# EAGLE design M103X (EAGLE 6.6.0)
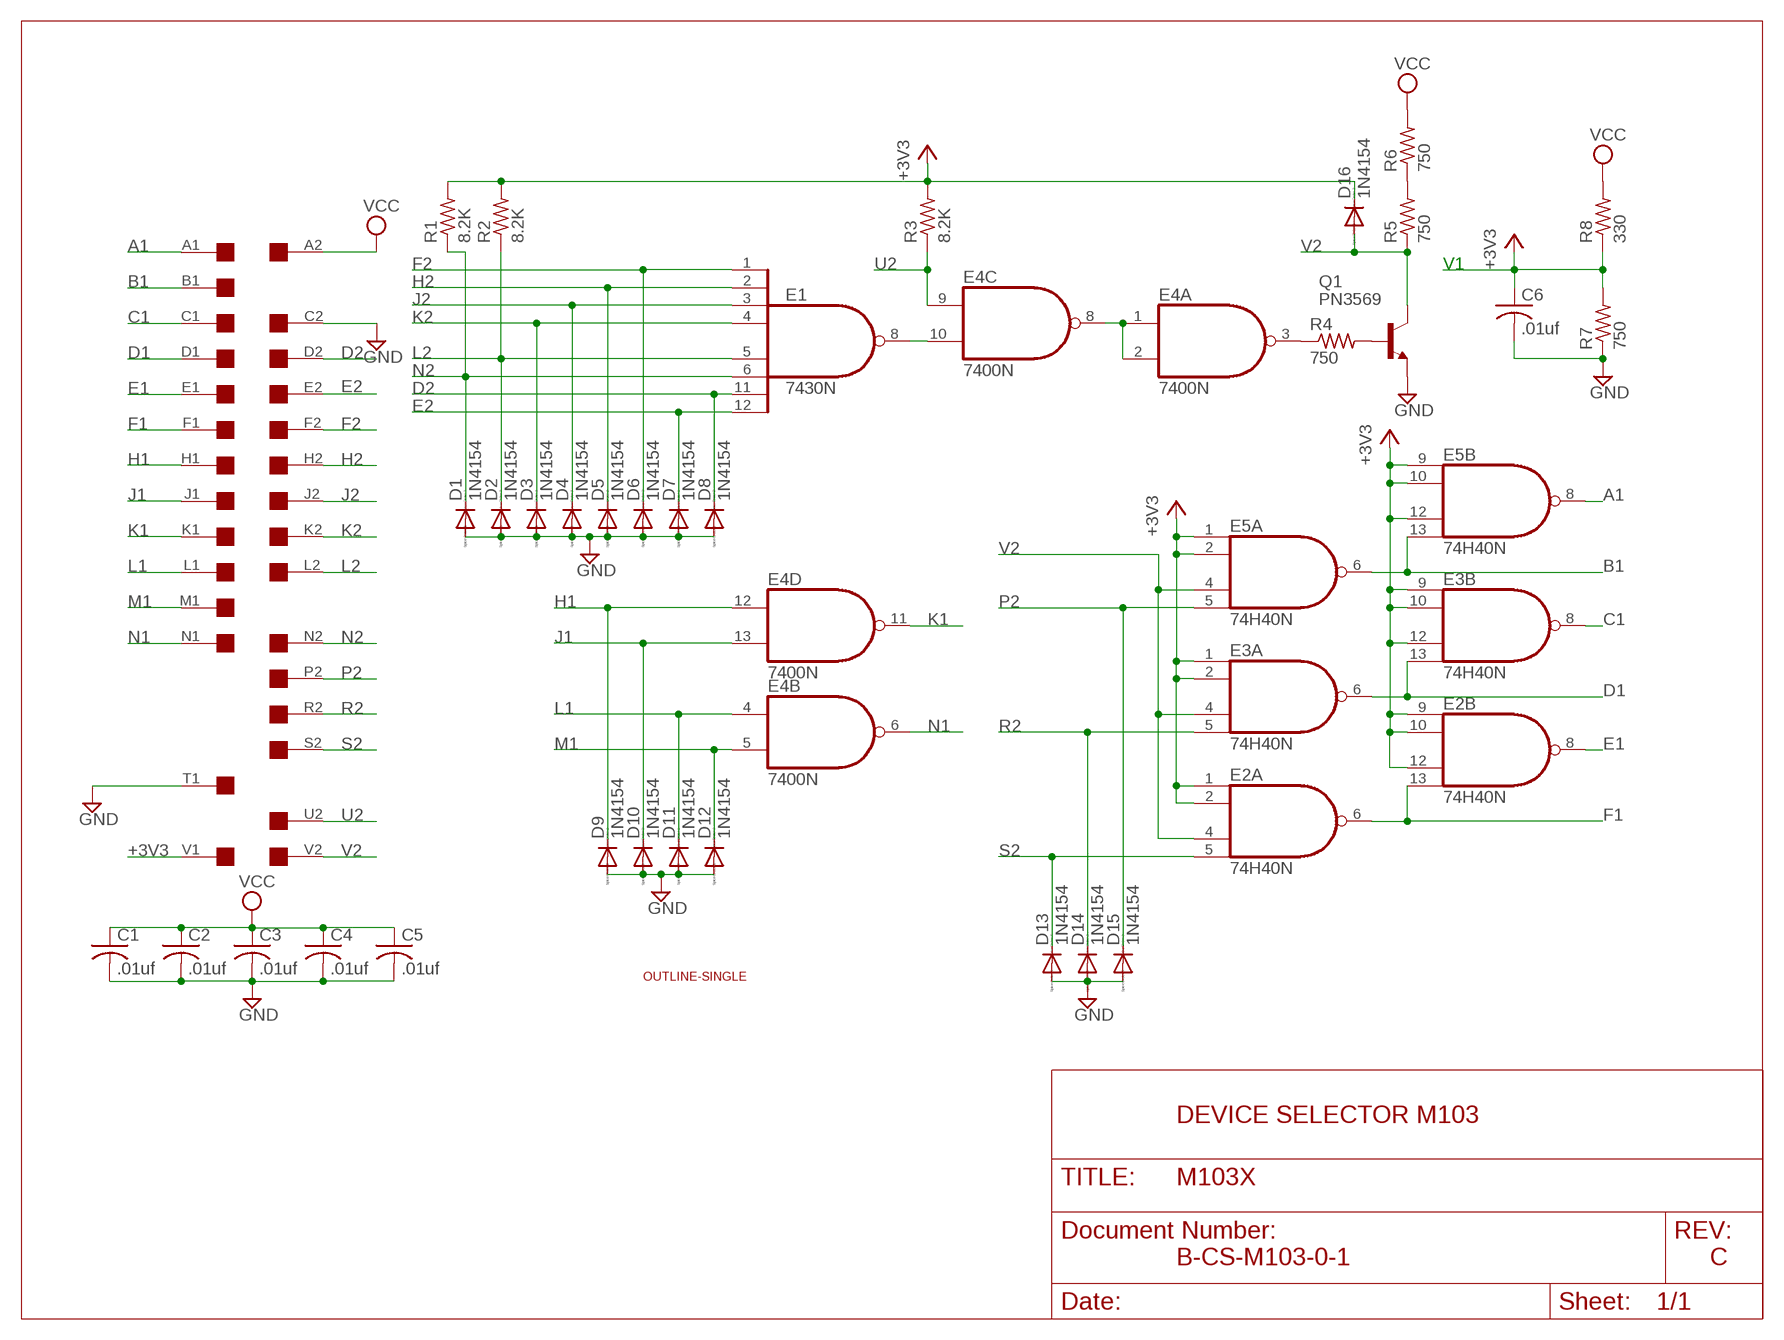
[diagram p0: schematic, sheet 1]

## Parts
C1  .01uf  C-US050-025X075  [C050-025X075]
C2  .01uf  C-US050-025X075  [C050-025X075]
C3  .01uf  C-US050-025X075  [C050-025X075]
C4  .01uf  C-US050-025X075  [C050-025X075]
C5  .01uf  C-US050-025X075  [C050-025X075]
C6  .01uf  C-US050-025X075  [C050-025X075]
D1  1N4154  1N4148DO35-10  [DO35-10]
D2  1N4154  1N4148DO35-10  [DO35-10]
D3  1N4154  1N4148DO35-10  [DO35-10]
D4  1N4154  1N4148DO35-10  [DO35-10]
D5  1N4154  1N4148DO35-10  [DO35-10]
D6  1N4154  1N4148DO35-10  [DO35-10]
D7  1N4154  1N4148DO35-10  [DO35-10]
D8  1N4154  1N4148DO35-10  [DO35-10]
D9  1N4154  1N4148DO35-10  [DO35-10]
D10  1N4154  1N4148DO35-10  [DO35-10]
D11  1N4154  1N4148DO35-10  [DO35-10]
D12  1N4154  1N4148DO35-10  [DO35-10]
D13  1N4154  1N4148DO35-10  [DO35-10]
D14  1N4154  1N4148DO35-10  [DO35-10]
D15  1N4154  1N4148DO35-10  [DO35-10]
D16  1N4154  1N4148DO35-10  [DO35-10]
E1  7430N  [DIL14]
E2  74H40N  74S20N  [DIL14]
E3  74H40N  74S20N  [DIL14]
E4  7400N  [DIL14]
E5  74H40N  74S20N  [DIL14]
Q1  PN3569  2N1613-NPN-TO39-EBC  [TO39]
R1  8.2K  R-US_0207/10  [0207/10]
R2  8.2K  R-US_0207/10  [0207/10]
R3  8.2K  R-US_0207/10  [0207/10]
R4  750  R-US_0207/10  [0207/10]
R5  750  R-US_0207/10  [0207/10]
R6  750  R-US_0207/10  [0207/10]
R7  750  R-US_0207/10  [0207/10]
R8  330  R-US_0207/10  [0207/10]
U$8  SINGLE  [EDGE-CON2]
U$9  OUTLINE-SINGLE  [SINGLE]

## Nets
+3V3: C6.1 D16.C E2.1(A:I0) E2.2(A:I1) E2.9(B:I0) E2.10(B:I1) E2.12(B:I2) E3.1(A:I0) E3.2(A:I1) E3.9(B:I0) E3.10(B:I1) E3.12(B:I2) E5.1(A:I0) E5.2(A:I1) E5.9(B:I0) E5.10(B:I1) E5.12(B:I2) R1.2 R2.2 R3.2 R7.2 R8.1 U$8.V1
A1: E5.8(B:O) U$8.A1
B1: E5.6(A:O) E5.13(B:I3) U$8.B1
C1: E3.8(B:O) U$8.C1
D1: E3.6(A:O) E3.13(B:I3) U$8.D1
D2: D8.C E1.11(I6) U$8.D2
E1: E2.8(B:O) U$8.E1
E2: D7.C E1.12(I7) U$8.E2
F1: E2.6(A:O) E2.13(B:I3) U$8.F1
F2: D6.C E1.1(I0) U$8.F2
GND: C1.2 C2.2 C3.2 C4.2 C5.2 C6.2 D1.A D2.A D3.A D4.A D5.A D6.A D7.A D8.A D9.A D10.A D11.A D12.A D13.A D14.A D15.A Q1.1(E) R7.1 U$8.C2 U$8.T1
H1: D9.C E4.12(D:I0) U$8.H1
H2: D5.C E1.2(I1) U$8.H2
J1: D10.C E4.13(D:I1) U$8.J1
J2: D4.C E1.3(I2) U$8.J2
K1: E4.11(D:O) U$8.K1
K2: D3.C E1.4(I3) U$8.K2
L1: D11.C E4.4(B:I0) U$8.L1
L2: D2.C E1.5(I4) R2.1 U$8.L2
M1: D12.C E4.5(B:I1) U$8.M1
N1: E4.6(B:O) U$8.N1
N2: D1.C E1.6(I5) R1.1 U$8.N2
N$2: E4.3(A:O) R4.1
N$3: Q1.2(B) R4.2
N$5: R5.2 R6.1
N$8: E1.8(O) E4.10(C:I1)
N$9: E4.1(A:I0) E4.2(A:I1) E4.8(C:O)
P2: D15.C E5.5(A:I3) U$8.P2
R2: D14.C E3.5(A:I3) U$8.R2
S2: D13.C E2.5(A:I3) U$8.S2
U2: E4.9(C:I0) R3.1 U$8.U2
V2: D16.A E2.4(A:I2) E3.4(A:I2) E5.4(A:I2) Q1.3(C) R5.1 U$8.V2
VCC: C1.1 C2.1 C3.1 C4.1 C5.1 R6.2 R8.2 U$8.A2
Unconnected: U$8.B2 U$8.M2 U$8.P1 U$8.R1 U$8.S1 U$8.T2 U$8.U1

## Notes on the sheet
- V1
- DEVICE SELECTOR M103
- B-CS-M103-0-1 | C

## Power pins joined to a net without a drawn wire
GND: E1.7(GND) E2.7(P:GND) E3.7(P:GND) E4.7(P:GND) E5.7(P:GND)
VCC: E1.14(VCC) E2.14(P:VCC) E3.14(P:VCC) E4.14(P:VCC) E5.14(P:VCC)

## Library data of the parts
C1-C6 = rcl:C-US: CAPACITOR, American symbol
D1-D16 = diode:1N4148: DIODE high speed (Philips)
E1 = 74xx-us:74*30: 8-input NAND gate
E2 E3 E5 = 74xx-us:74*20: Dual 4-input NAND gate
E4 = 74xx-us:74*00: Quad 2-input NAND gate
Q1 = transistor:*-NPN-: NPN Transistror BF959 corrected 2008.03.06
R1-R8 = rcl:R-US_: RESISTOR, American symbol
U$8 = dec-con:SINGLE: Single-Height DEC board
U$9 = dec-con:OUTLINE-*: Board outlines for DEC boards.

## Board
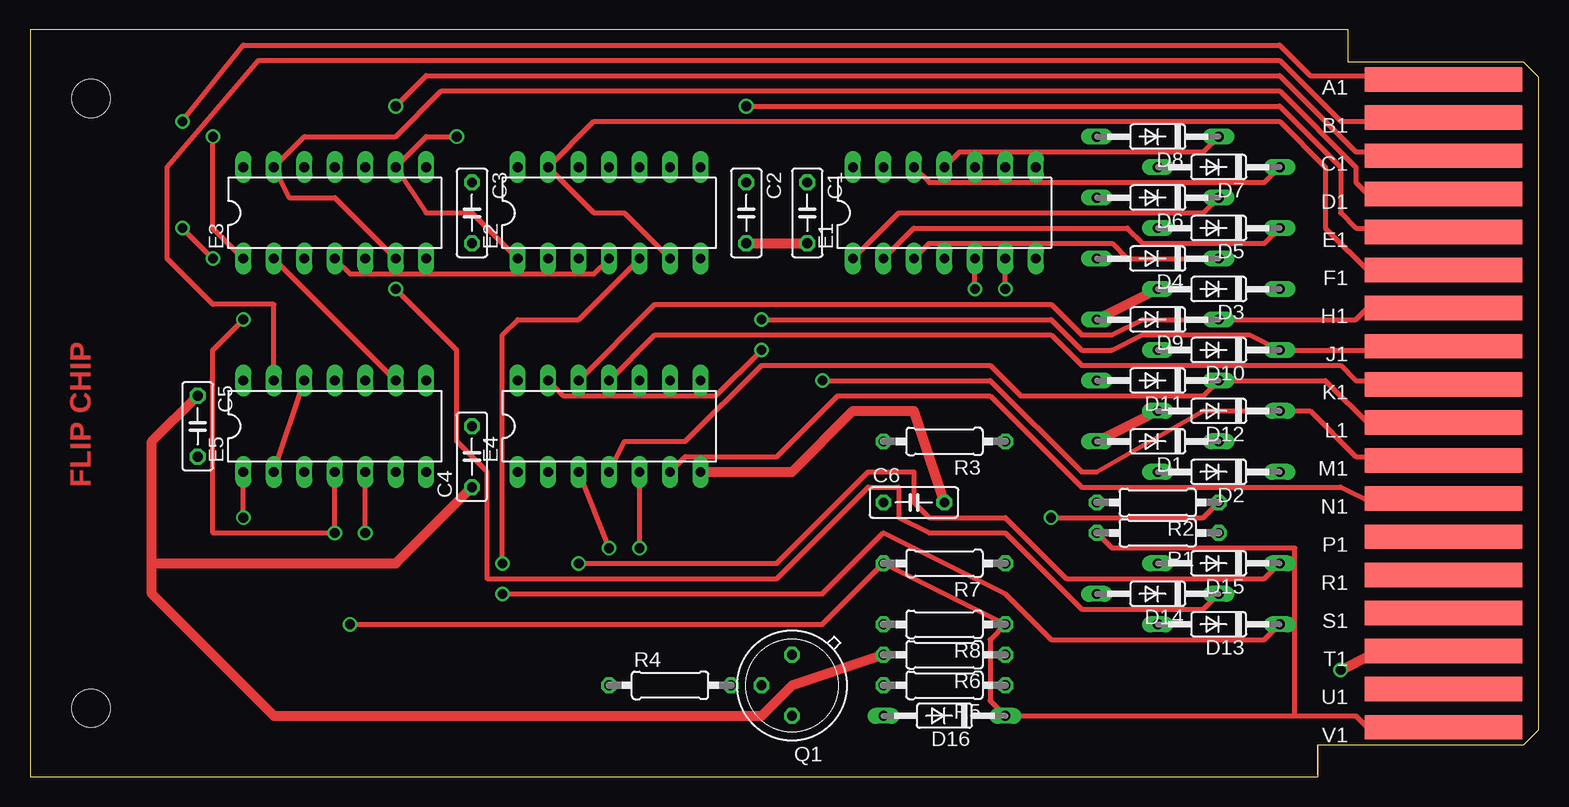
[diagram p1: board, top side]
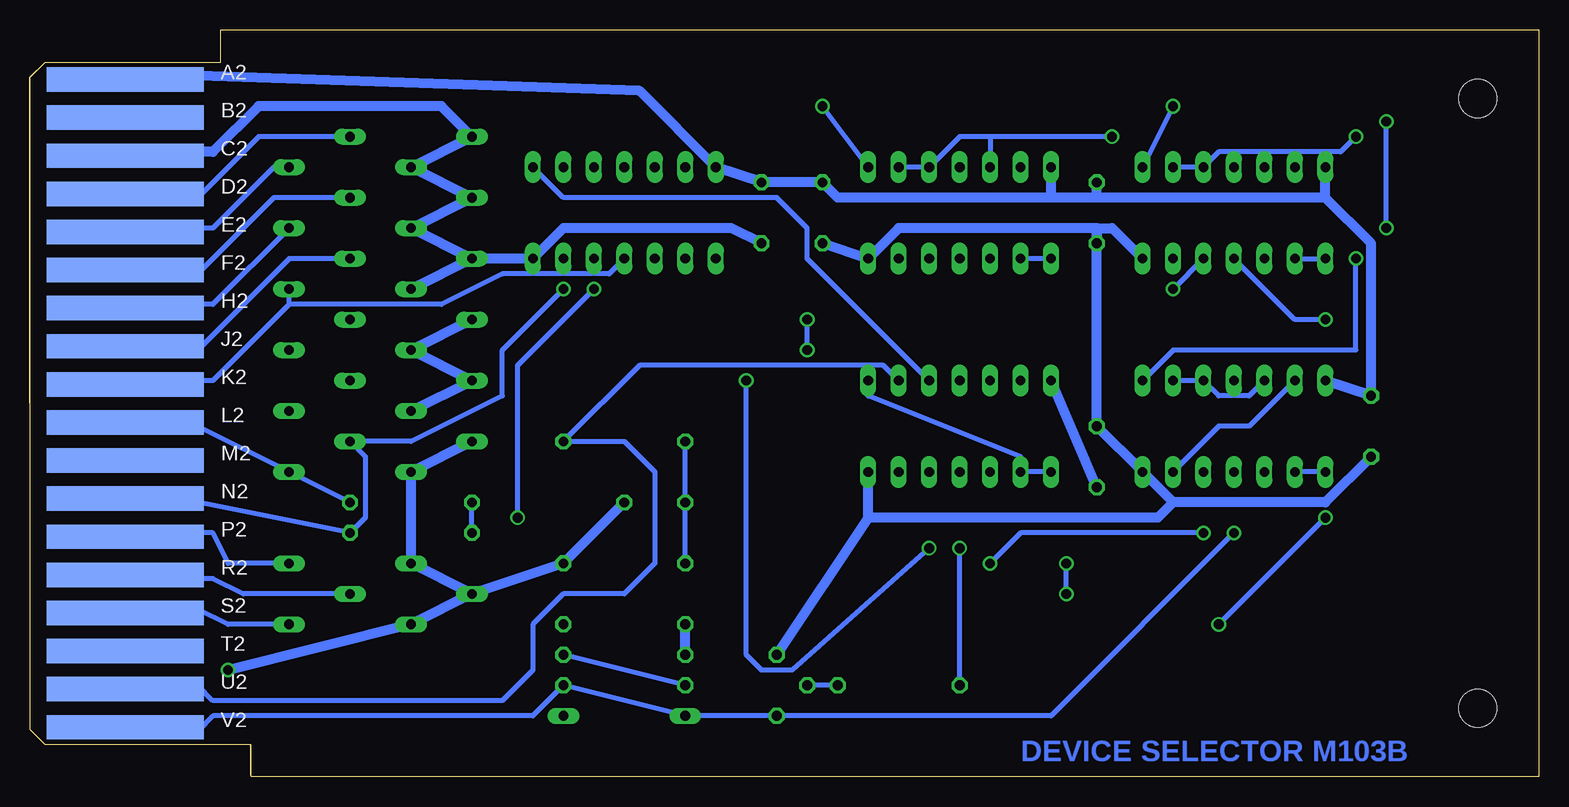
[diagram p2: board, bottom side, seen from below]

Size 125.73 x 62.23 mm. Coordinates in mm from the lower left corner, seen from the top.
Copper layers (1+16): Top 0.035mm / dielectric 1.5mm / Bottom 0.035mm
Design rules "16mils": minimum track width 16mil, minimum drill 32mil, track to track 15mil, track to pad 10mil, pad to pad 10mil, via to via 10mil, smd to smd 10mil, copper to edge 13mil, drill to drill 10mil, minimum pad ring 10mil, minimum via ring 8mil, stop-mask expansion 0mil, vias tented up to drill 0mil, thermal gap 10mil

### Footprints (pad centres in the part's own frame; a part is rotated, then mirrored left to right if it is on the bottom)
C050-025X075 = drill 0.813 octagon: 1 -2.54,0; 2 2.54,0
DO35-10 = drill 0.813 long: A 5.08,0; C -5.08,0
DIL14 = drill 0.813 long: 1 -7.62,-3.81; 2 -5.08,-3.81; 3 -2.54,-3.81; 4 0,-3.81; 5 2.54,-3.81; 6 5.08,-3.81; 7 7.62,-3.81; 8 7.62,3.81; 9 5.08,3.81; 10 2.54,3.81; 11 0,3.81; 12 -2.54,3.81; 13 -5.08,3.81; 14 -7.62,3.81
TO39 = drill 0.813 octagon: 1 0,-2.54; 2 2.54,0; 3 0,2.54
0207/10 = drill 0.813 octagon: 1 -5.08,0; 2 5.08,0
EDGE-CON2 = smd 13.106 x 2.032: A1 7.938,4.128; B1 7.938,7.303; C1 7.938,10.477; D1 7.938,13.652; E1 7.938,16.828; F1 7.938,20.003; H1 7.938,23.177; J1 7.938,26.352; K1 7.938,29.527; L1 7.938,32.703; M1 7.938,35.877; N1 7.938,39.053; P1 7.938,42.227; R1 7.938,45.403; S1 7.938,48.578; T1 7.938,51.752; U1 7.938,54.928; V1 7.938,58.102 | smd 13.106 x 2.032 bottom: A2 7.938,4.128; B2 7.938,7.303; C2 7.938,10.477; D2 7.938,13.652; E2 7.938,16.828; F2 7.938,20.003; H2 7.938,23.177; J2 7.938,26.352; K2 7.938,29.527; L2 7.938,32.703; M2 7.938,35.877; N2 7.938,39.053; P2 7.938,42.227; R2 7.938,45.403; S2 7.938,48.578; T2 7.938,51.752; U2 7.938,54.928; V2 7.938,58.102
SINGLE = hole 3.175: 120.65,56.515; 120.65,5.715

### Placement (x,y rotation side)
C1  64.77,46.99 270 top
C2  59.69,46.99 270 top
C3  36.83,46.99 270 top
C4  36.83,26.67 90 top
C5  13.97,29.21 270 top
C6  73.66,22.86 0 top
D1  93.98,27.94 180 top
D2  99.06,25.4 180 top
D3  99.06,40.64 180 top
D4  93.98,43.18 180 top
D5  99.06,45.72 180 top
D6  93.98,48.26 180 top
D7  99.06,50.8 180 top
D8  93.98,53.34 180 top
D9  93.98,38.1 180 top
D10  99.06,35.56 180 top
D11  93.98,33.02 180 top
D12  99.06,30.48 180 top
D13  99.06,12.7 180 top
D14  93.98,15.24 180 top
D15  99.06,17.78 180 top
D16  76.2,5.08 180 top
E1  76.2,46.99 0 top
E2  48.26,46.99 0 top
E3  25.4,46.99 0 top
E4  48.26,29.21 0 top
E5  25.4,29.21 0 top
Q1  63.5,7.62 180 top
R1  93.98,20.32 180 top
R2  93.98,22.86 180 top
R3  76.2,27.94 180 top
R4  53.34,7.62 0 top
R5  76.2,7.62 180 top
R6  76.2,10.16 180 top
R7  76.2,17.78 180 top
R8  76.2,12.7 180 top
U$8  125.73,62.23 180 top
U$9  125.73,62.23 180 top

### Tracks (layer width: path | path; a pad name or v marks a point on that pad's centre or on a via)
+3V3  (via drill 0.81)
  Top 0.406: U$8.V1 111.76,3.81 110.49,5.08 105.41,5.08 | 105.41,5.08 D16.C 80.01,6.35 80.01,11.43 R8.1 R7.2 66.04,12.7 v26.67,12.7 | R1.2 90.17,19.05 105.41,19.05 105.41,5.08 | E5.9 E3.2 | v15.24,53.34 15.24,45.72 E3.1 | v17.78,21.59 E5.1 | E5.2 E5.12 | v35.56,53.34 33.02,53.34 E3.9 33.02,46.99 36.83,46.99 E2.1
  Bottom 0.406: R7.2 C6.1 R3.2 | R1.2 R2.2 | E2.1 E2.2 | E3.9 E3.10 26.67,52.07 22.86,52.07 | 22.86,52.07 E3.12 | 22.86,52.07 16.51,52.07 v15.24,53.34 | E3.2 E3.1 | E5.9 E5.10 26.67,31.75 24.13,31.75 E5.12 | E5.1 E5.2 | v26.67,12.7 v17.78,21.59 | v35.56,53.34 45.72,53.34 | 45.72,53.34 E2.12 | 45.72,53.34 48.26,53.34 E2.10 E2.9
A1  (via drill 0.81)
  Top 0.406: U$8.A1 111.76,58.02 111.76,58.42 106.68,58.42 104.14,60.96 17.78,60.96 v12.7,54.61 | v15.24,43.18 v12.7,45.72
  Bottom 0.406: v12.7,45.72 v12.7,54.61 | E5.8 30.48,35.56 15.24,35.56 v15.24,43.18
B1
  Top 0.406: U$8.B1 112.05,54.9 111.76,54.61 109.22,54.61 104.14,59.69 19.05,59.69 11.43,50.8 11.43,43.18 15.24,39.37 20.32,39.37 E5.13
  Bottom 0.406: E5.6 26.67,29.21 24.13,29.21 E5.13
C1  (via drill 0.81)
  Top 0.406: U$8.C1 112.09,51.74 111.76,52.07 110.49,52.07 104.14,58.42 33.02,58.42 v30.48,55.88
  Bottom 0.406: E3.8 v30.48,55.88
D1
  Top 0.406: U$8.D1 112.06,48.56 111.76,48.26 110.49,49.53 110.49,50.8 104.14,57.15 34.29,57.15 30.48,53.34 22.86,53.34 E3.13 21.59,48.26 25.4,48.26 E3.6
D2
  Top 0.406: D8.C 97.79,52.07 77.47,52.07 E1.11
  Bottom 0.406: U$8.D2 111.76,48.26 106.68,53.34 D8.C
E1  (via drill 0.81)
  Top 0.406: U$8.E1 111.76,45.72 110.49,45.72 109.22,46.99 109.22,50.8 104.14,55.88 v59.69,55.88
  Bottom 0.406: E2.8 v59.69,55.88
E2
  Top 0.406: D7.C 102.87,49.53 74.93,49.53 E1.12
  Bottom 0.406: U$8.E2 111.76,45.72 110.49,45.72 105.41,50.8 D7.C
F1
  Top 0.406: U$8.F1 111.76,41.91 107.95,45.72 107.95,50.8 104.14,54.61 46.99,54.61 E2.13 46.99,46.99 49.53,46.99 E2.6
F2
  Top 0.406: D6.C 97.79,46.99 72.39,46.99 E1.1
  Bottom 0.406: U$8.F2 111.76,41.91 105.41,48.26 D6.C
GND  (via drill 0.81)
  Top 0.813: D3.A D9.A | D1.A D12.A | U$8.T1 111.76,10.16 v109.22,8.89 | C2.2 C1.2 | C6.2 73.66,30.48 68.58,30.48 63.5,25.4 E4.7
  Bottom 0.813: D4.A D5.A D6.A D7.A D8.A 91.44,55.88 106.68,55.88 110.49,52.07 111.76,52.07 U$8.C2 | D4.A E1.7 81.28,45.72 67.31,45.72 C1.2 | D4.A D3.A | D9.A D10.A D11.A D12.A | D1.A D2.A D15.A D14.A | D14.A D13.A v109.22,8.89 | C6.2 R7.1 D14.A | C5.2 17.78,22.86 30.48,22.86 | 30.48,22.86 E5.7 C4.2 36.83,45.72 | 36.83,45.72 C3.2 | 36.83,45.72 53.34,45.72 E2.7 C2.2 | E3.7 35.56,45.72 36.83,45.72 | 55.88,21.59 Q1.1 | 55.88,21.59 E4.7 | 55.88,21.59 31.75,21.59 30.48,22.86
H1
  Top 0.406: U$8.H1 111.76,39.37 110.49,38.1 D9.C 92.71,38.1 90.17,36.83 87.63,36.83 85.09,39.37 52.07,39.37 E4.12
H2
  Top 0.406: D5.C 102.87,44.45 92.71,44.45 91.44,45.72 73.66,45.72 E1.2
  Bottom 0.406: U$8.H2 111.76,39.37 110.49,39.37 D5.C
J1  (via drill 0.81)
  Top 0.406: U$8.J1 111.76,35.56 D10.C 101.6,36.83 92.71,36.83 90.17,35.56 87.63,35.56 85.09,38.1 v60.96,38.1 | E4.13 44.45,31.75 57.15,31.75 v60.96,35.56
  Bottom 0.406: v60.96,35.56 v60.96,38.1
J2
  Top 0.406: D4.C 91.44,43.18 90.17,44.45 74.93,44.45 E1.3
  Bottom 0.406: U$8.J2 111.76,35.56 104.14,43.18 D4.C
K1
  Top 0.406: U$8.K1 111.76,33.02 110.49,33.02 109.22,34.29 87.63,34.29 85.09,36.83 52.07,36.83 E4.11
K2
  Bottom 0.406: U$8.K2 111.76,33.02 110.49,33.02 104.14,39.37 | 104.14,39.37 D3.C | 104.14,39.37 91.44,39.37 86.36,41.91 77.47,41.91 E1.4
L1
  Top 0.406: U$8.L1 111.76,29.21 107.95,33.02 D11.C 97.79,31.75 82.55,31.75 80.01,34.29 60.96,34.29 54.61,27.94 49.53,27.94 E4.4
L2  (via drill 0.81)
  Top 0.406: R2.1 97.79,21.59 v85.09,21.59 | v78.74,40.64 E1.5
  Bottom 0.406: U$8.L2 111.76,29.21 D2.C R2.1 | v85.09,21.59 85.09,34.29 v78.74,40.64
M1  (via drill 0.81)
  Top 0.406: U$8.M1 111.76,26.67 110.49,26.67 106.68,30.48 D12.C 97.79,30.48 88.9,25.4 87.63,25.4 80.01,33.02 v66.04,33.02 | v50.8,19.05 E4.5
  Bottom 0.406: v50.8,19.05 62.23,8.89 64.77,8.89 66.04,10.16 v66.04,33.02
N1
  Top 0.406: U$8.N1 111.76,22.86 109.22,24.13 87.63,24.13 80.01,31.75 67.31,31.75 62.23,26.67 54.61,26.67 E4.6
N2  (via drill 0.81)
  Top 0.406: v81.28,40.64 E1.6
  Bottom 0.406: U$8.N2 111.76,23.18 111.76,22.86 R1.1 97.79,21.59 97.79,26.67 D1.C 93.98,27.94 86.36,31.75 86.36,35.56 v81.28,40.64
N$2  (via drill 0.81)
  Top 0.406: v48.26,19.05 E4.3
  Bottom 0.406: R4.1 v48.26,19.05
N$3
  Bottom 0.406: R4.2 Q1.2
N$5
  Bottom 0.406: R5.2 R6.1
N$8
  Bottom 0.406: E1.8 81.28,48.26 63.5,48.26 60.96,45.72 60.96,43.18 E4.10
N$9
  Bottom 0.406: E4.1 E4.2 43.18,26.67 55.88,31.75 E4.8
P2  (via drill 0.81)
  Top 0.406: v27.94,20.32 E5.5 | v45.72,17.78 62.23,17.78 69.85,25.4 73.66,25.4 73.66,22.86 74.93,21.59 81.28,21.59 86.36,16.51 102.87,16.51 D15.C
  Bottom 0.406: U$8.P2 111.76,20.32 110.49,20.32 109.22,17.78 D15.C | v27.94,20.32 43.18,20.32 v45.72,17.78
R2  (via drill 0.81)
  Top 0.406: D14.C 97.79,13.97 87.63,13.97 81.28,20.32 74.93,20.32 72.39,21.59 72.39,24.13 69.85,24.13 62.23,16.51 38.1,16.51 38.1,25.4 35.56,27.94 35.56,35.56 v30.48,40.64
  Bottom 0.406: U$8.R2 111.76,16.51 110.49,16.51 107.95,15.24 D14.C | v30.48,40.64 E3.5
S2  (via drill 0.81)
  Top 0.406: D13.C 102.87,11.43 85.09,11.43 81.28,15.24 71.12,20.32 66.04,15.24 v39.37,15.24 | v39.37,17.78 39.37,36.83 40.64,38.1 45.72,38.1 E2.5
  Bottom 0.406: U$8.S2 111.76,13.97 109.22,12.7 D13.C | v39.37,15.24 v39.37,17.78
U2
  Bottom 0.406: U$8.U2 111.76,7.62 110.49,6.35 86.36,6.35 83.82,8.89 83.82,12.7 81.28,15.24 76.2,15.24 73.66,17.78 73.66,25.4 76.2,27.94 R3.1 74.93,34.29 54.61,34.29 E4.9
V2  (via drill 0.81)
  Top 0.406: E5.4 v25.4,20.32 15.24,20.32 15.24,35.56 v17.78,38.1 | E3.4 26.67,41.91 46.99,41.91 E2.4
  Bottom 0.406: U$8.V2 111.76,3.81 110.49,5.08 83.82,5.08 R5.1 D16.A Q1.3 40.64,5.08 v25.4,20.32 | E3.4 20.32,38.1 v17.78,38.1
VCC
  Top 0.813: R6.2 63.5,7.62 60.96,5.08 20.32,5.08 10.16,15.24 10.16,17.78 | 10.16,17.78 10.16,27.94 C5.1 | C4.1 30.48,17.78 10.16,17.78
  Bottom 0.813: U$8.A2 111.76,58.42 74.93,57.15 E1.14 C1.1 C2.1 58.42,48.26 40.64,48.26 | 40.64,48.26 E2.14 | 36.83,48.26 C3.1 | 36.83,48.26 40.64,48.26 | 17.78,48.26 E3.14 | 17.78,48.26 36.83,48.26 | 17.78,48.26 13.97,44.45 C5.1 E5.14 | R6.2 R8.2 | C4.1 E4.14

### Text on the board
Top: FLIP CHIP
Bottom: DEVICE SELECTOR M103B